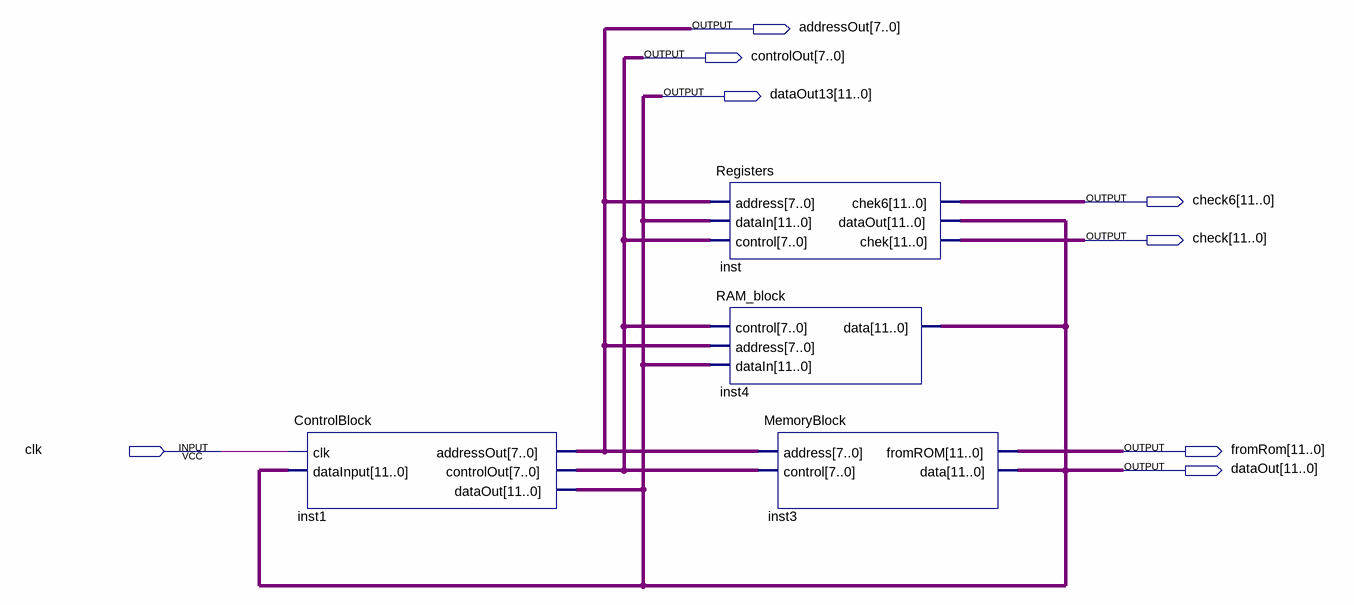
[diagram p0: schematic sheet]
// Quartus schematic laba4.bdf as structural Verilog: 4 symbols, 8 pins
module laba4 (
  input  clk,
  output [7:0] addressOut,
  output [7:0] controlOut,
  output [11:0] dataOut13,
  output [11:0] check6,
  output [11:0] check,
  output [11:0] fromRom,
  output [11:0] dataOut
);

  ControlBlock inst1 (
    .clk(clk), .dataInput(dataOut), .addressOut(addressOut), .controlOut(controlOut), .dataOut(dataOut));
  Registers inst (
    .address(addressOut), .dataIn(dataOut), .control(controlOut), .chek6(check6), .dataOut(dataOut),
    .chek(check));
  RAM_block inst4 (.control(controlOut), .address(addressOut), .dataIn(dataOut), .data(dataOut));
  MemoryBlock inst3 (.address(addressOut), .control(controlOut), .fromROM(fromRom), .data(dataOut));

  assign dataOut13 = dataOut;
endmodule
